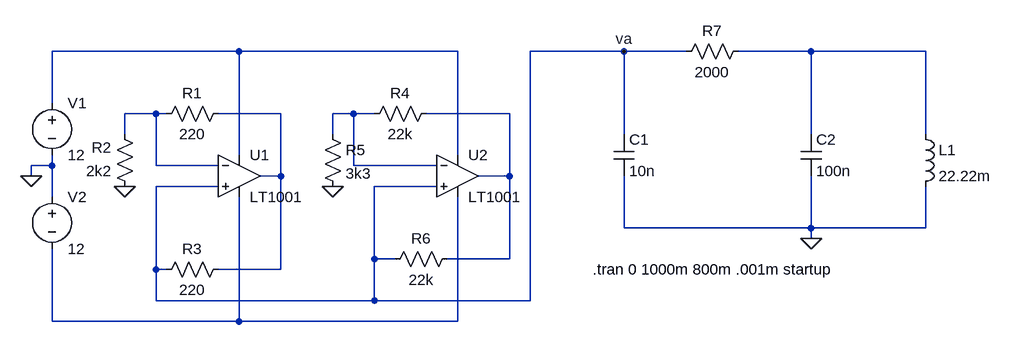
[diagram p0: schematic chua1.asc]
chua1.asc, the LTspice schematic file:
Version 4
SHEET 1 1376 680
WIRE 208 0 -80 0
WIRE 544 0 208 0
WIRE 800 0 656 0
WIRE 896 0 800 0
WIRE 1088 0 976 0
WIRE 1264 0 1088 0
WIRE -80 80 -80 0
WIRE 80 96 32 96
WIRE 96 96 80 96
WIRE 272 96 176 96
WIRE 384 96 352 96
WIRE 416 96 384 96
WIRE 624 96 496 96
WIRE 32 128 32 96
WIRE 352 128 352 96
WIRE 800 128 800 0
WIRE 1088 128 1088 0
WIRE 1264 128 1264 0
WIRE 208 160 208 0
WIRE 544 160 544 0
WIRE -80 176 -80 160
WIRE -80 176 -112 176
WIRE 80 176 80 96
WIRE 176 176 80 176
WIRE 384 176 384 96
WIRE 512 176 384 176
WIRE -112 192 -112 176
WIRE 272 192 272 96
WIRE 272 192 240 192
WIRE 624 192 624 96
WIRE 624 192 576 192
WIRE 176 208 80 208
WIRE 512 208 416 208
WIRE -80 224 -80 176
WIRE 800 272 800 192
WIRE 1088 272 1088 192
WIRE 1088 272 800 272
WIRE 1264 272 1264 208
WIRE 1264 272 1088 272
WIRE 1088 288 1088 272
WIRE 416 320 416 208
WIRE 448 320 416 320
WIRE 624 320 624 192
WIRE 624 320 528 320
WIRE 80 336 80 208
WIRE 96 336 80 336
WIRE 272 336 272 192
WIRE 272 336 176 336
WIRE 80 384 80 336
WIRE 416 384 416 320
WIRE 416 384 80 384
WIRE 656 384 656 0
WIRE 656 384 416 384
WIRE -80 416 -80 304
WIRE 208 416 208 224
WIRE 208 416 -80 416
WIRE 544 416 544 224
WIRE 544 416 208 416
FLAG -112 192 0
FLAG 32 208 0
FLAG 352 208 0
FLAG 1088 288 0
FLAG 800 0 va
SYMBOL Opamps\\LT1001 208 128 R0
SYMATTR InstName U1
SYMBOL voltage -80 64 R0
WINDOW 123 0 0 Left 2
WINDOW 39 0 0 Left 2
SYMATTR InstName V1
SYMATTR Value 12
SYMBOL voltage -80 208 R0
WINDOW 123 0 0 Left 2
WINDOW 39 0 0 Left 2
SYMATTR InstName V2
SYMATTR Value 12
SYMBOL Opamps\\LT1001 544 128 R0
SYMATTR InstName U2
SYMBOL res 192 80 R90
WINDOW 0 0 56 VBottom 2
WINDOW 3 32 56 VTop 2
SYMATTR InstName R1
SYMATTR Value 220
SYMBOL res 48 224 R180
WINDOW 0 36 76 Left 2
WINDOW 3 36 40 Left 2
SYMATTR InstName R2
SYMATTR Value 2k2
SYMBOL res 80 352 R270
WINDOW 0 32 56 VTop 2
WINDOW 3 0 56 VBottom 2
SYMATTR InstName R3
SYMATTR Value 220
SYMBOL res 400 112 R270
WINDOW 0 32 56 VTop 2
WINDOW 3 0 56 VBottom 2
SYMATTR InstName R4
SYMATTR Value 22k
SYMBOL res 336 112 R0
SYMATTR InstName R5
SYMATTR Value 3k3
SYMBOL res 544 304 R90
WINDOW 0 0 56 VBottom 2
WINDOW 3 32 56 VTop 2
SYMATTR InstName R6
SYMATTR Value 22k
SYMBOL cap 784 128 R0
SYMATTR InstName C1
SYMATTR Value 10n
SYMBOL res 992 -16 R90
WINDOW 0 0 56 VBottom 2
WINDOW 3 32 56 VTop 2
SYMATTR InstName R7
SYMATTR Value 2000
SYMBOL cap 1072 128 R0
SYMATTR InstName C2
SYMATTR Value 100n
SYMBOL ind 1248 112 R0
SYMATTR InstName L1
SYMATTR Value 22.22m
TEXT 752 336 Left 2 !.tran 0 1000m 800m .001m startup

The netlist it stands for:
* chua1.asc
XU1 va N003 N001 N007 N004 LT1001  ; pins In+ In- V+ V- OUT
V1 N001 0 12
V2 0 N007 12
XU2 va N005 N001 N007 N006 LT1001  ; pins In+ In- V+ V- OUT
R1 N004 N003 220
R2 0 N003 2k2
R3 va N004 220
R4 N005 N006 22k
R5 N005 0 3k3
R6 N006 va 22k
C1 va 0 10n
R7 N002 va 2000
C2 N002 0 100n
L1 N002 0 22.22m
.tran 0 1000m 800m .001m startup
.lib LTC.lib
.backanno
.end